# Altium project pca10040.PrjPCB (part 1 of 2)
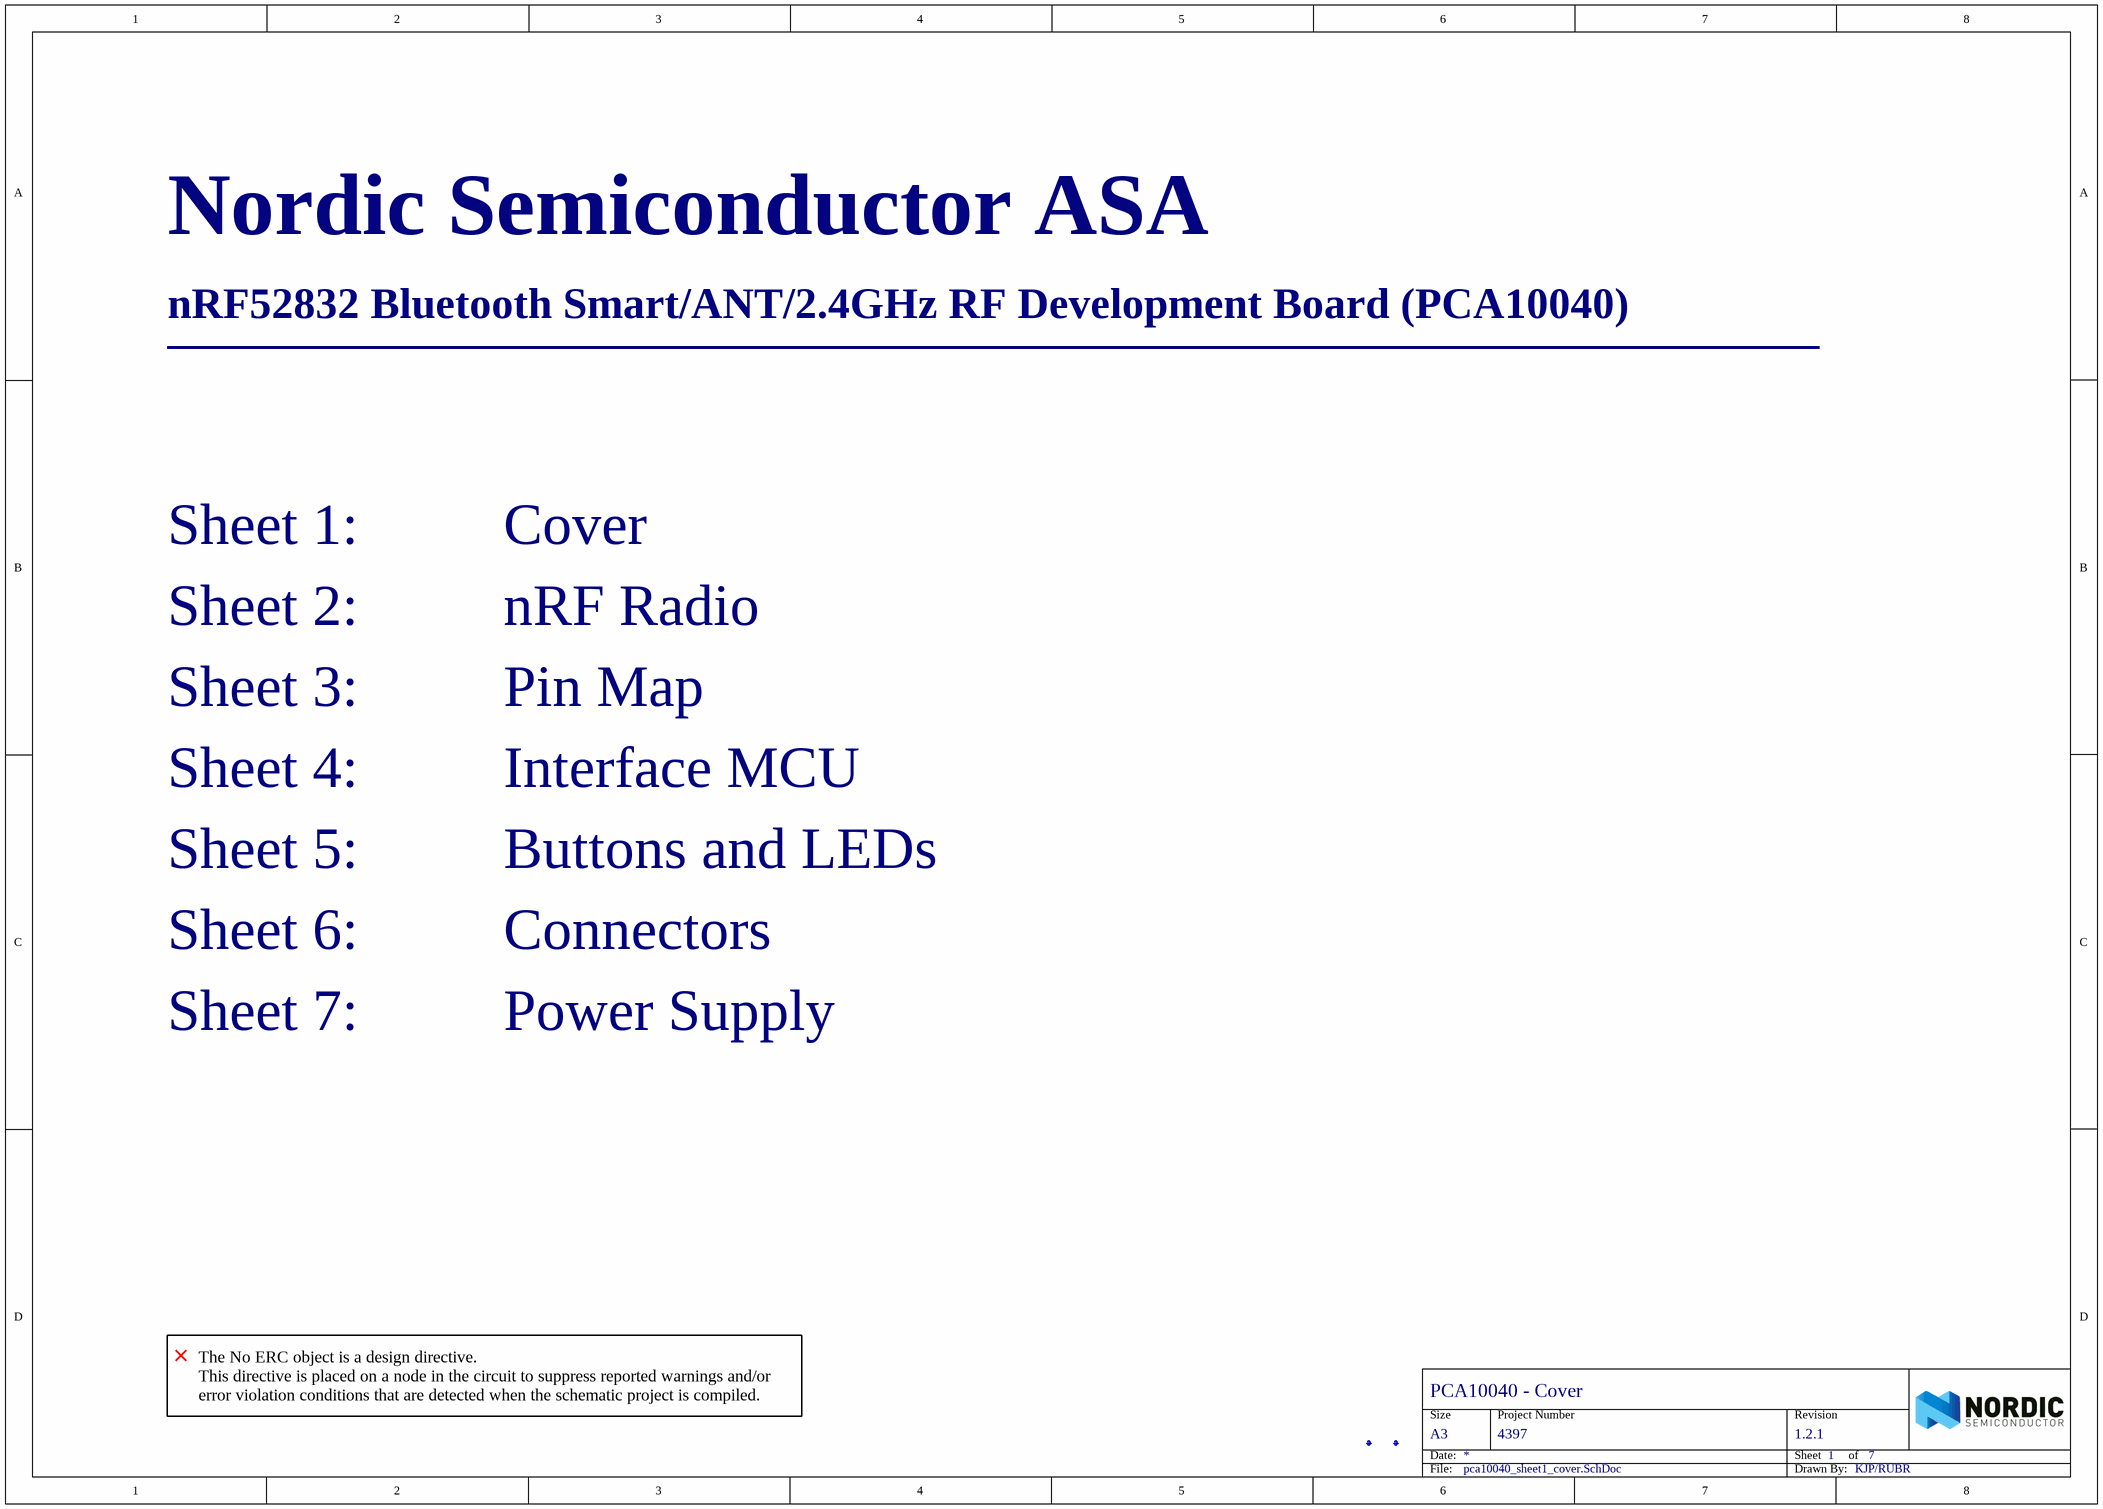
[diagram p0: pca10040_sheet1_cover.SchDoc]
7 sheets, 207 parts. Net scope: flat (ports and power ports of the same name join across sheets).
Board file: 400150.PcbDoc
Sheets:
  pca10040_sheet1_cover.SchDoc
  pca10040_sheet2_radio.SchDoc
  pca10040_sheet3_pin_map.SchDoc
  pca10040_sheet4_interface_mcu.SchDoc
  pca10040_sheet5_buttons_and_leds.SchDoc
  pca10040_sheet6_connectors.SchDoc
  pca10040_sheet7_power_supply.SchDoc

## Sheet pca10040_sheet1_cover.SchDoc: PCA10040 - Cover
size A3; Organization: Nordic Semiconductor; DocumentNumber: 1; Revision: 1.2.1; SheetNumber: 1; SheetTotal: 7; CompanyName: Nordic Semiconductor; DrawnBy: KJP/RUBR; ProjectNumber: 4397; DocumentSize: A3; PCBRevision: 0256RUBR; PCAName: PCA10040; PCBNumber: 400150; ProjectName: Quark

### Parts
Fid1  Fiducial mark  [Fiducial]  (value not drawn)
Fid2  Fiducial mark  [Fiducial]  (value not drawn)

### Notes on the sheet
- Nordic Semiconductor ASA
- nRF52832 Bluetooth Smart/ANT/2.4GHz RF Development Board (PCA10040)
- ________________________________________________________
- Sheet 1:          Cover
- Sheet 2:          nRF Radio
- Sheet 3:          Pin Map
- Sheet 4:          Interface MCU
- Sheet 5:          Buttons and LEDs
- Sheet 6:          Connectors
- Sheet 7:          Power Supply
- The No ERC object is a design directive.
  This directive is placed on a node in the circuit to suppress reported warnings and/or error violation conditions that are detected when the schematic project is compiled.
- Size
- Date:
- Project Number
- Sheet         of
- Revision
- File:
- Drawn By:

### Library data of the parts
Fid1 Fid2 = Fid-Mark: Artikkelnr Noca: N.A.; Part Number: Fid-Mark; Manufacturer: *; Manufacturer Part Number: *; Datasheet: *; LatestRevisionDate: 2009-12-12; Pin Count: 1; Publisher: Nordic Semiconductor; Published: 2009-12-12; Value: *; Note: *; Supplier: *; Supplier part number: *; 2nd source Supplier: *; 2nd source part number: *; Footprint Doc: Fiducial; Artikkelnr Simpro: N.A.

## Sheet pca10040_sheet2_radio.SchDoc: PCA10040 - nRF Radio
size A4; Organization: Nordic Semiconductor; DocumentNumber: 2; Revision: 1.2.1; SheetNumber: 2; SheetTotal: 7; CompanyName: Nordic Semiconductor; DrawnBy: KJP/RUBR; ProjectNumber: 4397; PCBRevision: 0256RUBR; DocumentSize: A4; PCAName: PCA10040; PCBNumber: 400150; ProjectName: Quark
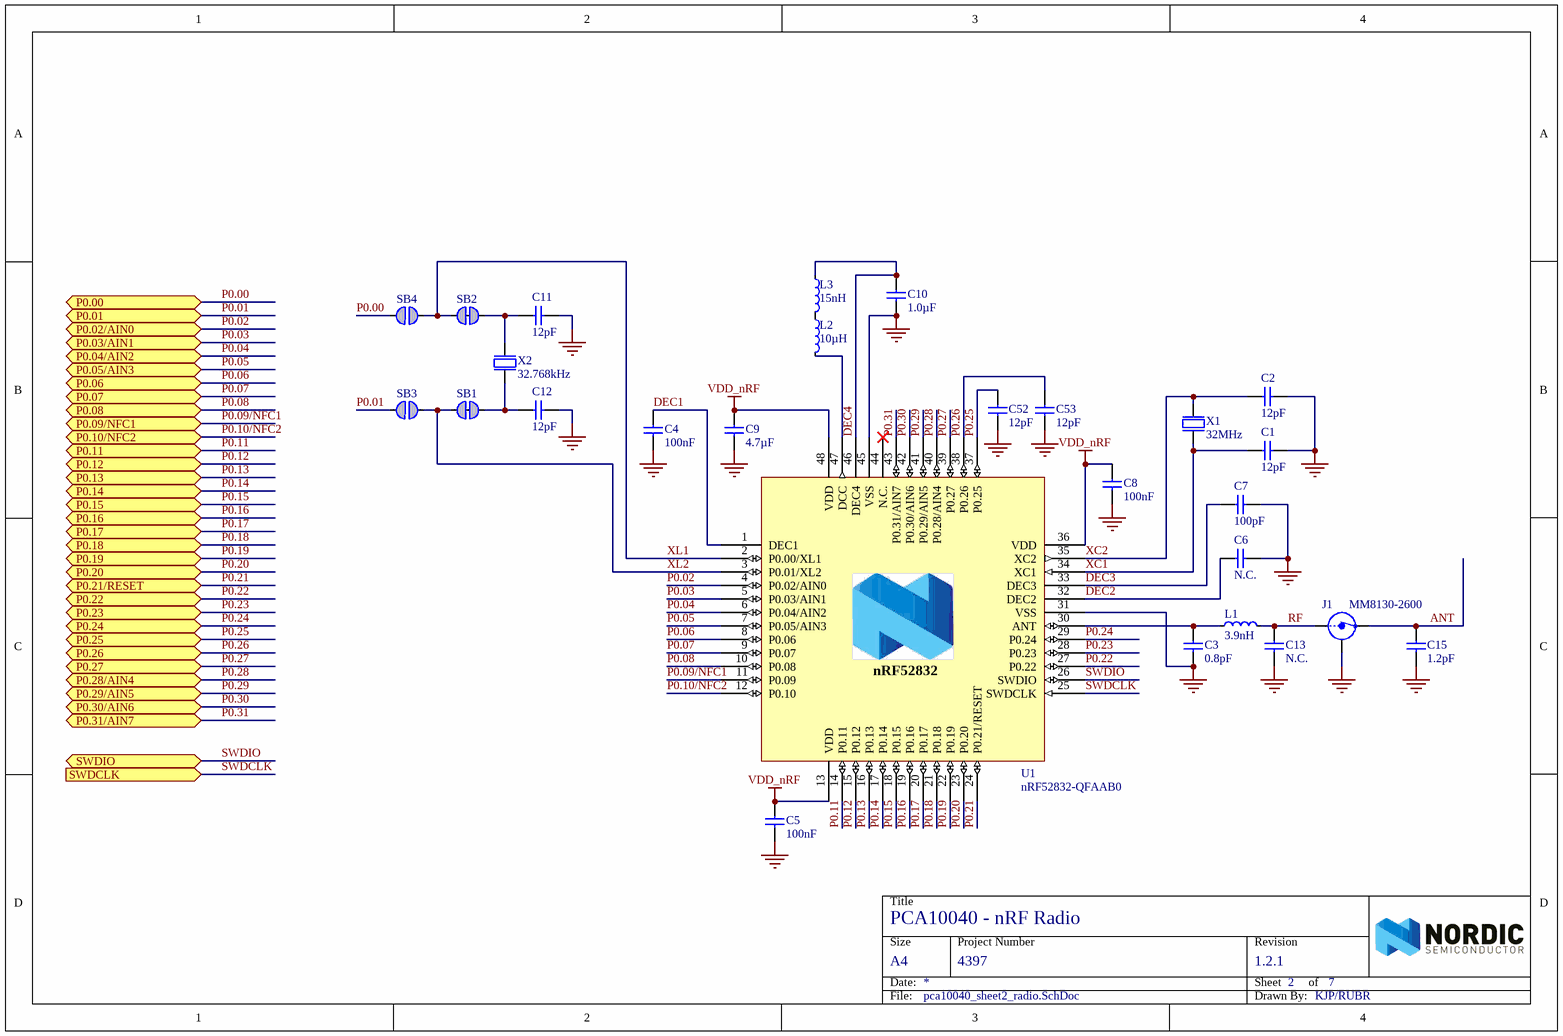
[diagram p1: pca10040_sheet2_radio.SchDoc]

### Parts
C1  12pF  [CAPC1005X04L]
C2  12pF  [CAPC1005X04L]
C3  0.8pF  [CAPC1005X04L]
C4  100nF  [CAPC1005X04L]
C5  100nF  [CAPC1005X04L]
C6  N.C.  [CAPC1005X04L]
C7  100pF  [CAPC1005X04L]
C8  100nF  [CAPC1005X04L]
C9  4.7µF  [CAPC1608X06L]
C10  1.0µF  [CAPC1608X06L]
C11  12pF  [CAPC1005X04L]
C12  12pF  [CAPC1005X04L]
C13  N.C.  [CAPC1005X04L]
C15  1.2pF  [CAPC1005X04L]
C52  12pF  [CAPC1005X04L]
C53  12pF  [CAPC1005X04L]
J1  MM8130-2600  [COAXIAL-SWF]
L1  3.9nH  [INDC1005X04L]
L2  10µH  [INDC1608X06L]
L3  15nH  [INDC1005X04L]
SB1  Solderbridge  [Solderbridge_Shorted]  (value not drawn)  (net tie, no BOM)
SB2  Solderbridge  [Solderbridge_Shorted]  (value not drawn)  (net tie, no BOM)
SB3  Solderbridge  [Solderbridge]  (value not drawn)  (no BOM)
SB4  Solderbridge  [Solderbridge]  (value not drawn)  (no BOM)
U1  nRF52832-QFAAB0  [QFN40P600X600X90-48N]
X1  32MHz  [BT-XTAL_2016]
X2  32.768kHz  [XTAL_3215]

### Ports
P0.00 (bidir), P0.01 (bidir), P0.02/AIN0 (bidir), P0.03/AIN1 (bidir), P0.04/AIN2 (bidir), P0.05/AIN3 (bidir), P0.06 (bidir), P0.07 (bidir), P0.08 (bidir), P0.09/NFC1 (bidir), P0.10/NFC2 (bidir), P0.11 (bidir), P0.12 (bidir), P0.13 (bidir), P0.14 (bidir), P0.15 (bidir), P0.16 (bidir), P0.17 (bidir), P0.18 (bidir), P0.19 (bidir), P0.20 (bidir), P0.21/RESET (bidir), P0.22 (bidir), P0.23 (bidir), P0.24 (bidir), P0.25 (bidir), P0.26 (bidir), P0.27 (bidir), P0.28/AIN4 (bidir), P0.29/AIN5 (bidir), P0.30/AIN6 (bidir), P0.31/AIN7 (bidir), SWDCLK (in), SWDIO (bidir)

### Nets
GND: C1.2 C2.2 C3.1 C4.2 C5.2 C6.2 C7.2 C8.2 C9.2 C10.1 C11.1 C12.1 C13.2 C15.2 C52.2 C53.2 J1.2(Shield) U1.31(VSS) U1.45(VSS) U1.49(GND) X1.2(GND) X1.4(GND)
VDD_nRF: C5.1 C8.1 C9.1 U1.13(VDD) U1.36(VDD) U1.48(VDD)
ANT: C15.1 J1.3(OUT)
DEC1: C4.1 U1.1(DEC1)
DEC2: C6.1 U1.32(DEC2)
DEC3: C7.1 U1.33(DEC3)
DEC4: C10.2 L3.1 U1.46(DEC4)
P0.00: SB4.2 ; port P0.00
P0.01: SB3.2 ; port P0.01
P0.02: U1.4(P0.02/AIN0) ; port P0.02/AIN0
P0.03: U1.5(P0.03/AIN1) ; port P0.03/AIN1
P0.04: U1.6(P0.04/AIN2) ; port P0.04/AIN2
P0.05: U1.7(P0.05/AIN3) ; port P0.05/AIN3
P0.06: U1.8(P0.06) ; port P0.06
P0.07: U1.9(P0.07) ; port P0.07
P0.08: U1.10(P0.08) ; port P0.08
P0.09/NFC1: U1.11(P0.09) ; port P0.09/NFC1
P0.10/NFC2: U1.12(P0.10) ; port P0.10/NFC2
P0.11: U1.14(P0.11) ; port P0.11
P0.12: U1.15(P0.12) ; port P0.12
P0.13: U1.16(P0.13) ; port P0.13
P0.14: U1.17(P0.14) ; port P0.14
P0.15: U1.18(P0.15) ; port P0.15
P0.16: U1.19(P0.16) ; port P0.16
P0.17: U1.20(P0.17) ; port P0.17
P0.18: U1.21(P0.18) ; port P0.18
P0.19: U1.22(P0.19) ; port P0.19
P0.20: U1.23(P0.20) ; port P0.20
P0.21: U1.24(P0.21/RESET) ; port P0.21/RESET
P0.22: U1.27(P0.22) ; port P0.22
P0.23: U1.28(P0.23) ; port P0.23
P0.24: U1.29(P0.24) ; port P0.24
P0.25: C52.1 U1.37(P0.25) ; port P0.25
P0.26: C53.1 U1.38(P0.26) ; port P0.26
P0.27: U1.39(P0.27) ; port P0.27
P0.28: U1.40(P0.28/AIN4) ; port P0.28/AIN4
P0.29: U1.41(P0.29/AIN5) ; port P0.29/AIN5
P0.30: U1.42(P0.30/AIN6) ; port P0.30/AIN6
P0.31: U1.43(P0.31/AIN7) ; port P0.31/AIN7
RF: C13.1 J1.1(IN) L1.2
SWDCLK: U1.25(SWDCLK) ; port SWDCLK
SWDIO: U1.26(SWDIO) ; port SWDIO
XC1: C1.1 U1.34(XC1) X1.1(inp)
XC2: C2.1 U1.35(XC2) X1.3(out)
XL1: SB2.2 SB4.1 U1.2(P0.00/XL1)
XL2: SB1.2 SB3.1 U1.3(P0.01/XL2)
NetC3_2: C3.2 L1.1 U1.30(ANT)
NetC11_2: C11.2 SB2.1 X2.1(inp)
NetC12_2: C12.2 SB1.1 X2.2(out)
NetL2_1: L2.1 L3.2
NetL2_2: L2.2 U1.47(DCC)

Not connected (* = marked no-connect by the designer): U1 44(N.C.)*

### Notes on the sheet
- Title
- Size
- Date:
- Project Number
- Sheet         of
- Revision
- File:
- Drawn By:
- (in symbol nRF52832-QFAAB0) nRF52832

### Library data of the parts
C1 C2 C11 C12 C52 C53 = C0402-12p: Capacitor, NP0, ±2%; Part number IPS: 00000002398; Note: 50V; Artikkelnr Noca: 20029159; Artikkelnr Simpro: N.A.; Part Number: C0402-12p; Manufacturer: *; Manufacturer Part Number: *; Datasheet: *; LatestRevisionDate: 2011-05-11; Pin Count: 2; Publisher: Nordic Semiconductor; Published: 2009-05-08; Value: 12pF; Supplier: *; Supplier part number: *; 2nd source Supplier: *; 2nd source part number: *; Footprint Doc: 0402
C3 = C0402-0.8p: Capacitor, NP0, ±5%; Note: 50V; Artikkelnr Noca: 20029147; Artikkelnr Simpro: N.A.; Part Number: C0402-0.8p; Manufacturer: *; Manufacturer Part Number: *; Datasheet: *; LatestRevisionDate: 2012-11-21; Pin Count: 2; Publisher: Nordic Semiconductor; Published: 2009-05-08; Value: 0.8pF; Supplier: *; Supplier part number: *; 2nd source Supplier: *; 2nd source part number: *; Footprint Doc: 0402
C4 C5 C8 = C0402-100n: Capacitor, X7R, ±10%; Part number IPS: 00000005296; Note: 16V; Artikkelnr Noca: 20039200; Artikkelnr Simpro: N.A.; Part Number: C0402-100n; Manufacturer: *; Manufacturer Part Number: *; Datasheet: *; LatestRevisionDate: 2009-11-23; Pin Count: 2; Publisher: Nordic Semiconductor; Published: 2009-05-08; Value: 100nF; Supplier: *; Supplier part number: *; 2nd source Supplier: *; 2nd source part number: *; Footprint Doc: 0402
C6 C13 = C0402-N.C.: Not mounted; Note: Chip Cap; Artikkelnr Noca: N.A.; Assembly: Not mounted; Part Number: C0402-N.C.; Manufacturer: *; Manufacturer Part Number: *; Datasheet: *; Footprint Doc: 0402; LatestRevisionDate: 2009-05-08; Pin Count: 2; Publisher: Nordic Semiconductor; Published: 2009-05-08; Value: N.C.; Supplier: *; Supplier part number: *; 2nd source Supplier: *; 2nd source part number: *; Artikkelnr Simpro: N.A.
C7 = C0402-100p: Capacitor, NP0, ±5%; Part number IPS: 00000002361; Note: 50V; Artikkelnr Noca: 20029135; Artikkelnr Simpro: N.A.; Part Number: C0402-100p; Manufacturer: *; Manufacturer Part Number: *; Datasheet: *; LatestRevisionDate: 2009-05-08; Pin Count: 2; Publisher: Nordic Semiconductor; Published: 2009-05-08; Value: 100pF; Supplier: *; Supplier part number: *; 2nd source Supplier: *; 2nd source part number: *; Footprint Doc: 0402
C9 = C0603-4µ7: Capacitor, X5R, ±10%; Part number IPS: 00000003141; Note: 6.3V; Artikkelnr Noca: 20069060; Artikkelnr Simpro: N.A.; Part Number: C0603-4µ7; Manufacturer: *; Manufacturer Part Number: *; Datasheet: *; LatestRevisionDate: 2009-11-23; Pin Count: 2; Publisher: Nordic Semiconductor; Published: 2009-05-08; Value: 4.7µF; Supplier: *; Supplier part number: *; 2nd source Supplier: *; 2nd source part number: *; Footprint Doc: 0603
C10 = C0603-1µ0: Capacitor, X7R, ±10%; Part number IPS: 00000000616; Note: 16V; Artikkelnr Noca: 20039335; Artikkelnr Simpro: N.A.; Part Number: C0603-1µ0; Manufacturer: *; Manufacturer Part Number: *; Datasheet: *; LatestRevisionDate: 2013-06-05; Pin Count: 2; Publisher: Nordic Semiconductor; Published: 2009-05-08; Value: 1.0µF; Supplier: *; Supplier part number: *; 2nd source Supplier: *; 2nd source part number: *; Footprint Doc: 0603
C15 = C0402-1.2p: Capacitor, NP0, ±0.1pF; Part number IPS: 00000005410; Note: 50V; Artikkelnr Noca: 20029157; Artikkelnr Simpro: N.A.; Part Number: C0402-1.2p; Manufacturer: *; Manufacturer Part Number: *; Datasheet: *; LatestRevisionDate: 2011-05-11; Pin Count: 2; Publisher: Nordic Semiconductor; Published: 2009-05-08; Value: 1.2pF; Supplier: *; Supplier part number: *; 2nd source Supplier: *; 2nd source part number: *; Footprint Doc: 0402
J1 = MM8130-2600: Coaxial Connector with Switch; Manufacturer: Murata; 2nd source part number: 81-MM8130-2600RA2; Artikkelnr Noca: 55029011; Artikkelnr Simpro: N.A.; Part Number: MM8130-2600; Manufacturer Part Number: MM8130-2600; Datasheet: http://www.murata.com/products/catalog/pdf/o33e.pdf; LatestRevisionDate: 2014-04-24; Pin Count: 3; Publisher: Nordic Semiconductor; Published: 2014-04-24; Value: MM8130-2600; Note: *; Supplier: Digi-Key; Supplier part number: 490-4981-1-ND; 2nd source Supplier: Mouser; Footprint Doc: COAXIAL-SWF
L1 = L0402-3n9: Inductor, 170mA, ±0.1nH; Manufacturer: Murata; Manufacturer Part Number: LQP15MN3N9B02D; Note: High frequency chip inductor ±5%; Artikkelnr Noca: 33029151; Artikkelnr Simpro: N.A.; Part Number: L0402-3n9; Datasheet: http://search.murata.co.jp/Ceramy/image/img/PDF/ENG/L0075S0084LQP15M.pdf; LatestRevisionDate: 2012-09-19; Pin Count: 2; Publisher: Nordic Semiconductor; Published: 2009-05-08; Value: 3.9nH; Supplier: Digi-Key; Supplier part number: 490-1131-1-ND; 2nd source Supplier: *; 2nd source part number: *; Footprint Doc: 0402; ComponentLink1Description: Datasheet; ComponentLink2Description: Supplier link
L2 = L0603-10µ: Inductor, 80mA, ±10%; Manufacturer: Taiyo Yuden; Manufacturer Part Number: LBMF1608T100K; 2nd source part number: 178-6105; Note: LBMF1608T100K 10µH 80mA 0603; Artikkelnr Noca: 33029314; Artikkelnr Simpro: N.A.; Part Number: L0603-10µ; Datasheet: http://www.yuden.co.jp/ut/product/pdf/elb2_e.pdf; LatestRevisionDate: 2012-09-19; Pin Count: 2; Publisher: Nordic Semiconductor; Published: 2010-02-24; Value: 10µH; Supplier: Digi-Key; Supplier part number: 587-1714-1-ND; 2nd source Supplier: Farnell; Footprint Doc: 0603; ComponentLink1Description: Datasheet; ComponentLink2Description: Supplier link
L3 = L0402-15n: Inductor, 320mA, ±5%; Manufacturer: Taiyo Yuden; Manufacturer Part Number: HK100515NJ-T; 2nd source part number: 658-1328; Note: High frequency chip inductor ±10%; Artikkelnr Noca: 33029323; Artikkelnr Simpro: N.A.; Part Number: L0402-15n; LatestRevisionDate: 2012-09-19; Pin Count: 2; Publisher: Nordic Semiconductor; Published: 2010-07-12; Value: 15nH; Supplier: Digi-Key; Datasheet: http://www.yuden.co.jp/productdata/catalog/en/mlci04_e.pdf; Supplier part number: 587-1521-1-ND; 2nd source Supplier: Farnell; Footprint Doc: 0402; ComponentLink1Description: Datasheet; ComponentLink2Description: Supplier link
SB1 SB2 = Solderbridge Shorted: Shorted Solderbridge; Artikkelnr Noca: N.A.; Part Number: Solderbridge Shorted; Manufacturer: *; Manufacturer Part Number: *; Datasheet: *; LatestRevisionDate: 2012-08-07; Pin Count: 2; Publisher: Nordic Semiconductor; Published: 2012-08-07; Value: Solderbridge; Note: *; Supplier: *; Supplier part number: *; 2nd source Supplier: *; 2nd source part number: *; Footprint Doc: Solderbridge_Shorted; Artikkelnr Simpro: N.A.
SB3 SB4 = Solderbridge: Artikkelnr Noca: N.A.; Part Number: Solderbridge; Manufacturer: *; Manufacturer Part Number: *; Datasheet: *; LatestRevisionDate: 2009-12-14; Pin Count: 2; Publisher: Nordic Semiconductor; Published: 2009-12-14; Value: Solderbridge; Note: *; Supplier: *; Supplier part number: *; 2nd source Supplier: *; 2nd source part number: *; Footprint Doc: Solderbridge; Artikkelnr Simpro: N.A.
U1 = nRF52832-QFAAB0: Multi-protocol Bluetooth Low Energy, ANT and 2.4GHz proprietary system-on-chip; Manufacturer: Nordic Semiconductor; Artikkelnr Noca: 15079334; Artikkelnr Simpro: N.A.; Part Number: nRF52832-QFAAB0; Manufacturer Part Number: nRF52832-QFAAB0; Datasheet: *; LatestRevisionDate: 2016-08-25; Pin Count: 48; Publisher: Nordic Semiconductor; Published: 2016-08-25; Value: nRF52832-QFAAB0; Note: *; Supplier: Nordic Semiconductor; Supplier part number: nRF52832-QFAAB0; 2nd source Supplier: *; 2nd source part number: *; Footprint Doc: QFN-48
X1 = XTAL_SMD2016_32MHz_8pF_Epson: XTAL SMD 2016, 32MHz, Cl=8pF, Tol: ±10ppm, Stab: ±10ppm; Manufacturer: Epson Toyocom; Manufacturer Part Number: Q22FA12800025; Note: XTAL SMD 32.000MHz; Artikkelnr Noca: 22019238; Artikkelnr Simpro: N.A.; Part Number: XTAL_SMD2016_32MHz_8pF_Epson; Datasheet: http://www.epsondevice.com/docs/qd/en/DownloadServlet?id=ID000449; LatestRevisionDate: 2014-11-27; Pin Count: 4; Publisher: Nordic Semiconductor; Published: 2012-03-09; Value: 32MHz; Supplier: Farnell; Supplier part number: 171-2806; 2nd source Supplier: *; 2nd source part number: *; Footprint Doc: XTAL_2016
X2 = XTAL_FC-135 32.768k: XTAL SMD 3215, 32.768kHz, 9pF, ±20ppm; Manufacturer: Epson Toyocom; Manufacturer Part Number: FC-135 32.768KHZ ±20PPM,9.0PF; 2nd source part number: 127-8037; Note: XTAL SMD 32.768kHz, 3215; Artikkelnr Noca: 22019091; Artikkelnr Simpro: N.A.; Part Number: XTAL_FC-135 32.768k; Datasheet: http://www.farnell.com/datasheets/57480.pdf; LatestRevisionDate: 2014-03-27; Pin Count: 2; Publisher: Nordic Semiconductor; Published: 2010-10-18; Value: 32.768kHz; Supplier: Digi-Key; Supplier part number: FC-135 32.7680KA-AC-ND; 2nd source Supplier: Farnell; Footprint Doc: XTAL_3215

## Sheet pca10040_sheet3_pin_map.SchDoc: PCA10056 - Pin Map
size A4; Organization: Nordic Semiconductor; DocumentNumber: 3; Revision: 1.2.1; SheetNumber: 3; SheetTotal: 7; CompanyName: Nordic Semiconductor; DrawnBy: RUBR; ProjectNumber: 4397; PCBRevision: 0256RUBR; DocumentSize: A4; PCAName: PCA10040; PCBNumber: 400150; ProjectName: nRF52840-DK
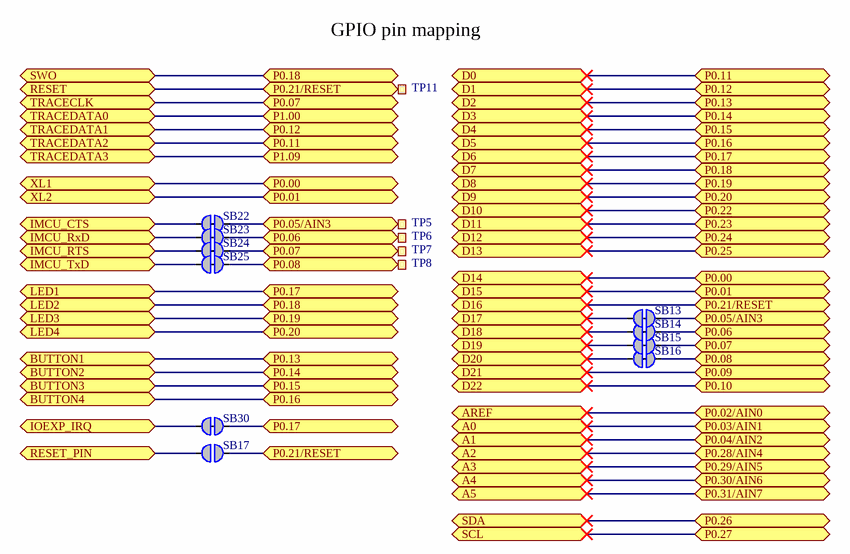
[diagram p2: pca10040_sheet3_pin_map.SchDoc]

### Parts
SB13  Solderbridge  [Solderbridge_Shorted]  (value not drawn)  (net tie, no BOM)
SB14  Solderbridge  [Solderbridge_Shorted]  (value not drawn)  (net tie, no BOM)
SB15  Solderbridge  [Solderbridge_Shorted]  (value not drawn)  (net tie, no BOM)
SB16  Solderbridge  [Solderbridge_Shorted]  (value not drawn)  (net tie, no BOM)
SB17  Solderbridge  [Solderbridge]  (value not drawn)  (no BOM)
SB22  Solderbridge  [Solderbridge_Shorted]  (value not drawn)  (net tie, no BOM)
SB23  Solderbridge  [Solderbridge_Shorted]  (value not drawn)  (net tie, no BOM)
SB24  Solderbridge  [Solderbridge_Shorted]  (value not drawn)  (net tie, no BOM)
SB25  Solderbridge  [Solderbridge_Shorted]  (value not drawn)  (net tie, no BOM)
SB30  Solderbridge  [Solderbridge_Shorted]  (value not drawn)  (net tie, no BOM)
TP5  Ø1.0mm,SMD  [TP_SMD_Ø1.0mm]  (value not drawn)  (no BOM)
TP6  Ø1.0mm,SMD  [TP_SMD_Ø1.0mm]  (value not drawn)  (no BOM)
TP7  Ø1.0mm,SMD  [TP_SMD_Ø1.0mm]  (value not drawn)  (no BOM)
TP8  Ø1.0mm,SMD  [TP_SMD_Ø1.0mm]  (value not drawn)  (no BOM)
TP11  Ø1.0mm,SMD  [TP_SMD_Ø1.0mm]  (value not drawn)  (no BOM)

### Ports
A0 (bidir), A1 (bidir), A2 (bidir), A3 (bidir), A4 (bidir), A5 (bidir), AREF (bidir), BUTTON1 (bidir), BUTTON2 (bidir), BUTTON3 (bidir), BUTTON4 (bidir), D0 (bidir), D1 (bidir), D2 (bidir), D3 (bidir), D4 (bidir), D5 (bidir), D6 (bidir), D7 (bidir), D8 (bidir), D9 (bidir), D10 (bidir), D11 (bidir), D12 (bidir), D13 (bidir), D14 (bidir), D15 (bidir), D16 (bidir), D17 (bidir), D18 (bidir), D19 (bidir), D20 (bidir), D21 (bidir), D22 (bidir), IMCU_CTS (bidir), IMCU_RTS (bidir), IMCU_RxD (bidir), IMCU_TxD (bidir), IOEXP_IRQ (bidir), LED1 (bidir), LED2 (bidir), LED3 (bidir), LED4 (bidir), P0.00 (bidir), P0.01 (bidir), P0.02/AIN0 (bidir), P0.03/AIN1 (bidir), P0.04/AIN2 (bidir), P0.05/AIN3 (bidir), P0.06 (bidir), P0.07 (bidir), P0.08 (bidir), P0.09 (bidir), P0.10 (bidir), P0.11 (bidir), P0.12 (bidir), P0.13 (bidir), P0.14 (bidir), P0.15 (bidir), P0.16 (bidir), P0.17 (bidir), P0.18 (bidir), P0.19 (bidir), P0.20 (bidir), P0.21/RESET (bidir), P0.22 (bidir), P0.23 (bidir), P0.24 (bidir), P0.25 (bidir), P0.26 (bidir), P0.27 (bidir), P0.28/AIN4 (bidir), P0.29/AIN5 (bidir), P0.30/AIN6 (bidir), P0.31/AIN7 (bidir), P1.00 (bidir), P1.09 (bidir), RESET (bidir), RESET_PIN (bidir), SCL (bidir), SDA (bidir), SWO (bidir), TRACECLK (bidir), TRACEDATA0 (bidir), TRACEDATA1 (bidir), TRACEDATA2 (bidir), TRACEDATA3 (bidir), XL1 (bidir), XL2 (bidir)

### Nets
D17: SB13.1 ; port D17
D18: SB14.1 ; port D18
D19: SB15.1 ; port D19
D20: SB16.1 ; port D20
D21: port D21, port P0.09
D22: port D22, port P0.10
IMCU_CTS: SB22.2 ; port IMCU_CTS
IMCU_RTS: SB24.2 ; port IMCU_RTS
IMCU_RxD: SB23.2 ; port IMCU_RxD
IMCU_TxD: SB25.2 ; port IMCU_TxD
IOEXP_IRQ: SB30.2 ; port IOEXP_IRQ
P0.00: port P0.00, port XL1, port D14
P0.01: port P0.01, port XL2, port D15
P0.02: port AREF, port P0.02/AIN0
P0.03: port A0, port P0.03/AIN1
P0.04: port A1, port P0.04/AIN2
P0.05: SB13.2 SB22.1 TP5.1 ; port P0.05/AIN3
P0.06: SB14.2 SB23.1 TP6.1 ; port P0.06
P0.07: SB15.2 SB24.1 TP7.1 ; port P0.07, port TRACECLK
P0.08: SB16.2 SB25.1 TP8.1 ; port P0.08
P0.11: port TRACEDATA2, port P0.11, port D0
P0.12: port TRACEDATA1, port P0.12, port D1
P0.13: port P0.13, port BUTTON1, port D2
P0.14: port P0.14, port BUTTON2, port D3
P0.15: port P0.15, port BUTTON3, port D4
P0.16: port P0.16, port BUTTON4, port D5
P0.17: SB30.1 ; port LED1, port D6, port P0.17
P0.18: port SWO, port P0.18, port LED2, port D7
P0.19: port LED3, port D8, port P0.19
P0.20: port LED4, port D9, port P0.20
P0.21: SB17.2 TP11.1 ; port RESET, port P0.21/RESET, port D16
P0.22: port D10, port P0.22
P0.23: port D11, port P0.23
P0.24: port D12, port P0.24
P0.25: port D13, port P0.25
P0.26: port P0.26, port SDA
P0.27: port P0.27, port SCL
P0.28: port A2, port P0.28/AIN4
P0.29: port A3, port P0.29/AIN5
P0.30: port A4, port P0.30/AIN6
P0.31: port A5, port P0.31/AIN7
P1.00: port TRACEDATA0, port P1.00
P1.09: port TRACEDATA3, port P1.09
RESET_PIN: SB17.1 ; port RESET_PIN

### Notes on the sheet
- (near TP11) GPIO pin mapping
- Title
- Size
- Date:
- Project Number
- Sheet         of
- Revision
- File:
- Drawn By:

### Library data of the parts
SB13-SB16 SB22-SB25 SB30 = Solderbridge Shorted: as SB1 on sheet pca10040_sheet2_radio; Part Number: Solderbridge Shorted; Manufacturer: *; Manufacturer Part Number: *; Datasheet: *; Footprint Doc: Solderbridge_Shorted; LatestRevisionDate: 2012-08-07; Pin Count: 2; Publisher: Nordic Semiconductor; Published: 2012-08-07; Value: Solderbridge; Note: *; Supplier: *; Supplier part number: *; 2nd source Supplier: *; 2nd source part number: *; Artikkelnr Simpro: N.A.
SB17 = Solderbridge: Artikkelnr Noca: N.A.; Part Number: Solderbridge; Manufacturer: *; Manufacturer Part Number: *; Datasheet: *; Footprint Doc: Solderbridge; LatestRevisionDate: 2009-12-14; Pin Count: 2; Publisher: Nordic Semiconductor; Published: 2009-12-14; Value: Solderbridge; Note: *; Supplier: *; Supplier part number: *; 2nd source Supplier: *; 2nd source part number: *; Artikkelnr Simpro: N.A.
TP5-TP8 TP11 = TP_SMD_Ø1.0MM: 1.0mm circular SMD testpad; Manufacturer: Nordic Semiconductor; Artikkelnr Noca: N.A.; Part Number: TP_SMD_Ø1.0MM; Manufacturer Part Number: *; Datasheet: *; LatestRevisionDate: 2013-06-11; Pin Count: 1; Publisher: Nordic Semiconductor; Published: 2013-06-11; Value: Ø1.0mm,SMD; Note: *; Supplier: *; Supplier part number: *; 2nd source Supplier: *; 2nd source part number: *; Footprint Doc: TP_SMD_Ø1.0mm; Artikkelnr Simpro: N.A.

## Sheet pca10040_sheet4_interface_mcu.SchDoc: PCA10040 - Interface MCU
size A3; Organization: Nordic Semiconductor; DocumentNumber: 4; Revision: 1.2.1; SheetNumber: 4; SheetTotal: 7; CompanyName: Nordic Semiconductor; DrawnBy: KJP/RUBR; ProjectNumber: 4397; PCAName: PCA10040; PCBRevision: 0256RUBR; DocumentSize: A3; PCBNumber: 400150; ProjectName: Quark
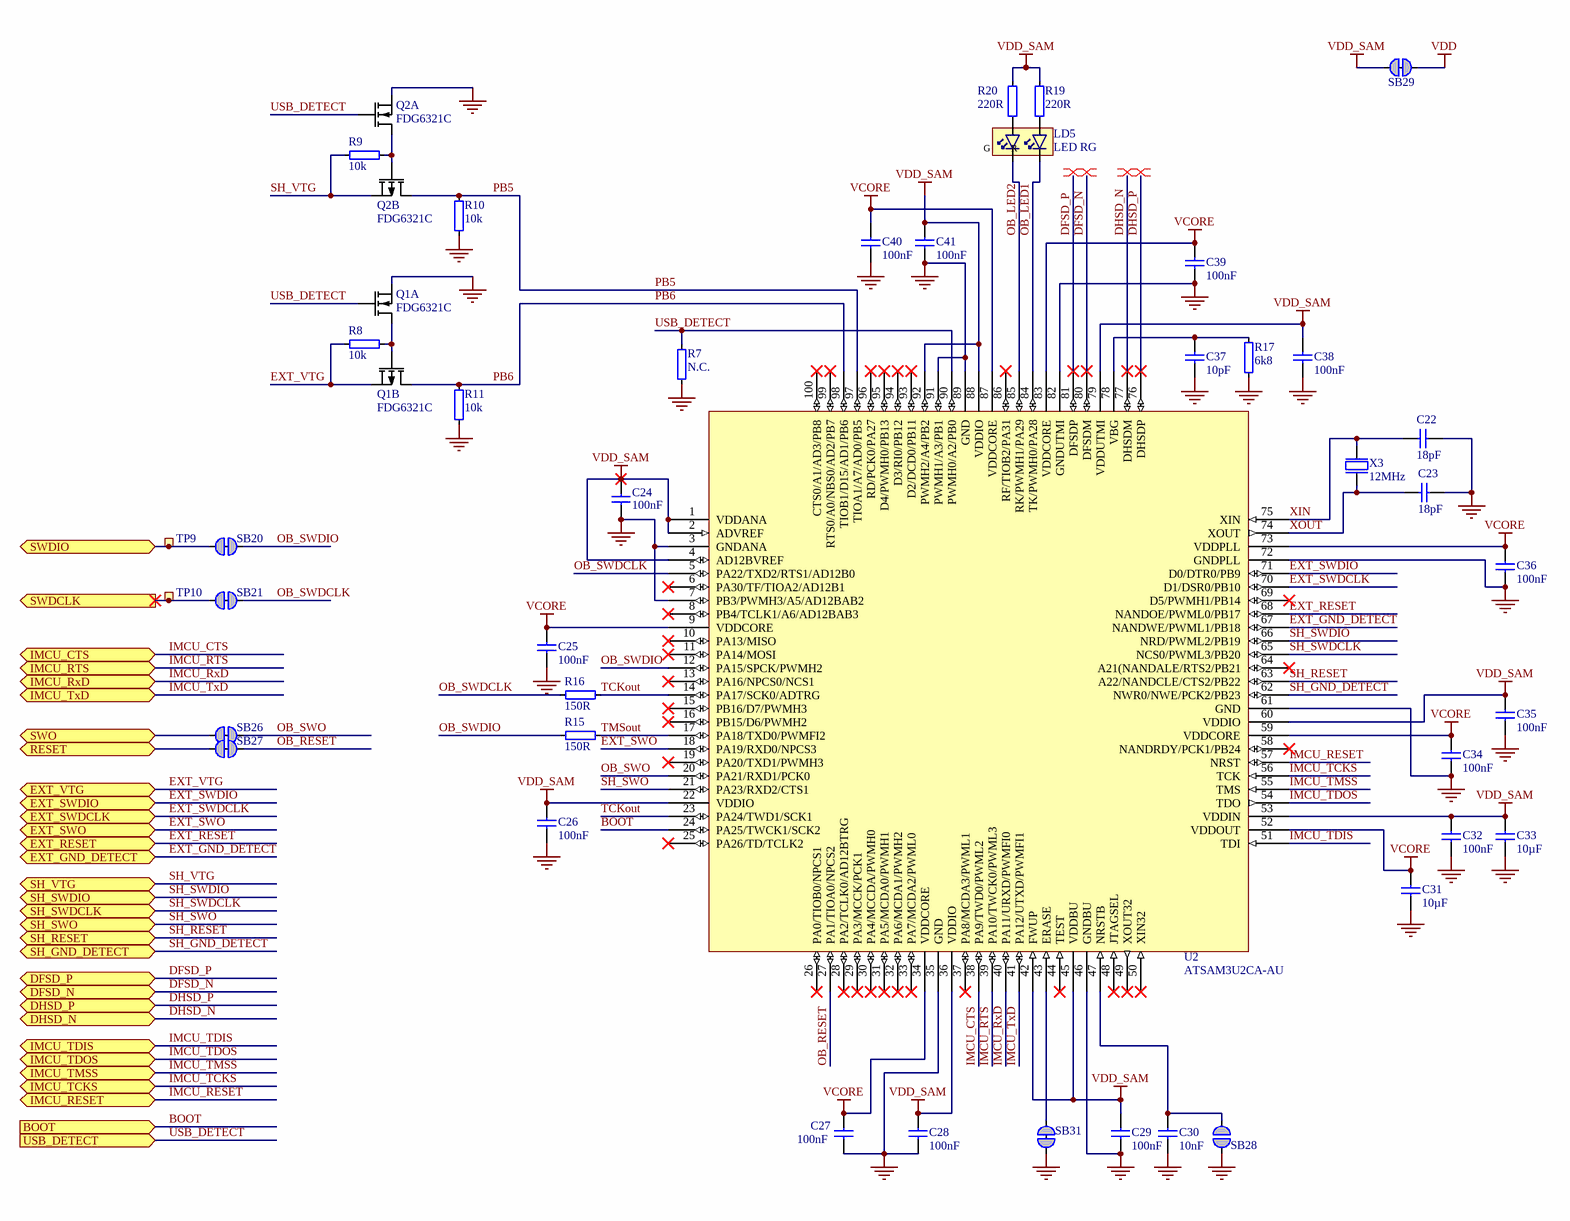
[diagram p3: pca10040_sheet4_interface_mcu.SchDoc]

### Parts
C22  18pF  [CAPC1005X04L]
C23  18pF  [CAPC1005X04L]
C24  100nF  [CAPC1005X04L]
C25  100nF  [CAPC1005X04L]
C26  100nF  [CAPC1005X04L]
C27  100nF  [CAPC1005X04L]
C28  100nF  [CAPC1005X04L]
C29  100nF  [CAPC1005X04L]
C30  10nF  [CAPC1005X04L]
C31  10µF  [CAPC1608X06L]
C32  100nF  [CAPC1005X04L]
C33  10µF  [CAPC1608X06L]
C34  100nF  [CAPC1005X04L]
C35  100nF  [CAPC1005X04L]
C36  100nF  [CAPC1005X04L]
C37  10pF  [CAPC1005X04L]
C38  100nF  [CAPC1005X04L]
C39  100nF  [CAPC1005X04L]
C40  100nF  [CAPC1005X04L]
C41  100nF  [CAPC1005X04L]
LD5  LED RG  [LED_DUAL_0606]
Q1  FDG6321C  [SOT65P210X100-6N]  (parts A,B of 2)
Q2  FDG6321C  [SOT65P210X100-6N]  (parts A,B of 2)
R7  N.C.  [RESC1005X04L]
R8  10k  [RESC1005X04L]
R9  10k  [RESC1005X04L]
R10  10k  [RESC1005X04L]
R11  10k  [RESC1005X04L]
R15  150R  [RESC1005X04L]
R16  150R  [RESC1005X04L]
R17  6k8  [RESC1005X04L]
R19  220R  [RESC1005X04L]
R20  220R  [RESC1005X04L]
SB20  Solderbridge  [Solderbridge_Shorted]  (value not drawn)  (net tie, no BOM)
SB21  Solderbridge  [Solderbridge_Shorted]  (value not drawn)  (net tie, no BOM)
SB26  Solderbridge  [Solderbridge_Shorted]  (value not drawn)  (net tie, no BOM)
SB27  Solderbridge  [Solderbridge_Shorted]  (value not drawn)  (net tie, no BOM)
SB28  Solderbridge  [Solderbridge]  (value not drawn)  (no BOM)
SB29  Solderbridge  [Solderbridge_Shorted]  (value not drawn)  (net tie, no BOM)
SB31  Solderbridge  [Solderbridge_Shorted]  (value not drawn)  (net tie, no BOM)
TP9  Ø1.0mm,SMD  [TP_SMD_Ø1.0mm]  (value not drawn)  (no BOM)
TP10  Ø1.0mm,SMD  [TP_SMD_Ø1.0mm]  (value not drawn)  (no BOM)
U2  ATSAM3U2CA-AU  [TSQFP50P1600X1600X160-100N]
X3  12MHz  [BT-XTAL_3225]

### Ports
BOOT (in), DFSD_N (bidir), DFSD_P (bidir), DHSD_N (bidir), DHSD_P (bidir), EXT_GND_DETECT (bidir), EXT_RESET (bidir), EXT_SWDCLK (bidir), EXT_SWDIO (bidir), EXT_SWO (bidir), EXT_VTG (bidir), IMCU_CTS (bidir), IMCU_RESET (bidir), IMCU_RTS (bidir), IMCU_RxD (bidir), IMCU_TCKS (bidir), IMCU_TDIS (bidir), IMCU_TDOS (bidir), IMCU_TMSS (bidir), IMCU_TxD (bidir), RESET (bidir), SH_GND_DETECT (bidir), SH_RESET (bidir), SH_SWDCLK (bidir), SH_SWDIO (bidir), SH_SWO (bidir), SH_VTG (bidir), SWDCLK (out), SWDIO (bidir), SWO (bidir), USB_DETECT (in)

### Nets
GND: C22.2 C23.2 C24.1 C25.1 C26.1 C27.1 C28.1 C29.1 C30.1 C31.1 C32.1 C33.1 C34.1 C35.1 C36.2 C37.1 C38.1 C39.1 C40.1 C41.1 Q1.1(S1) Q2.1(S1) R7.2 R10.1 R11.1 R17.1 SB28.2 SB31.2 U2.3(GNDANA) U2.7(PB3/PWMH3/A5/AD12BAB2) U2.35(GND) U2.46(GNDBU) U2.61(GND) U2.72(GNDPLL) U2.82(GNDUTMI) U2.89(GND) U2.91(PWMH1/A3/PB1) X3.2(GND) X3.4(GND)
VCORE: C25.2 C27.2 C31.2 C34.2 C36.1 C39.2 C40.2 U2.9(VDDCORE) U2.34(VDDCORE) U2.52(VDDOUT) U2.59(VDDCORE) U2.73(VDDPLL) U2.83(VDDCORE) U2.87(VDDCORE)
VDD: SB29.2
VDD_SAM: C24.2 C26.2 C28.2 C29.2 C32.2 C33.2 C35.2 C38.2 C41.2 R19.2 R20.2 SB29.1 U2.1(VDDANA) U2.2(ADVREF) U2.4(AD12BVREF) U2.22(VDDIO) U2.36(VDDIO) U2.42(FWUP) U2.45(VDDBU) U2.53(VDDIN) U2.60(VDDIO) U2.79(VDDUTMI) U2.88(VDDIO) U2.92(PWMH2/A4/PB2)
BOOT: U2.24(PA25/TWCK1/SCK2) ; port BOOT
DFSD_N: U2.80(DFSDM) ; port DFSD_N
DFSD_P: U2.81(DFSDP) ; port DFSD_P
DHSD_N: U2.77(DHSDM) ; port DHSD_N
DHSD_P: U2.76(DHSDP) ; port DHSD_P
EXT_GND_DETECT: U2.67(NANDWE/PWML1/PB18) ; port EXT_GND_DETECT
EXT_RESET: U2.68(NANDOE/PWML0/PB17) ; port EXT_RESET
EXT_SWDCLK: U2.70(D1/DSR0/PB10) ; port EXT_SWDCLK
EXT_SWDIO: U2.71(D0/DTR0/PB9) ; port EXT_SWDIO
EXT_SWO: U2.18(PA19/RXD0/NPCS3) ; port EXT_SWO
EXT_VTG: Q1.4(S2) R8.1 ; port EXT_VTG
IMCU_CTS: U2.38(PA9/TWD0/PWML2) ; port IMCU_CTS
IMCU_RESET: U2.57(NRST) ; port IMCU_RESET
IMCU_RTS: U2.39(PA10/TWCK0/PWML3) ; port IMCU_RTS
IMCU_RxD: U2.40(PA11/URXD/PWMFI0) ; port IMCU_RxD
IMCU_TCKS: U2.56(TCK) ; port IMCU_TCKS
IMCU_TDIS: U2.51(TDI) ; port IMCU_TDIS
IMCU_TDOS: U2.54(TDO) ; port IMCU_TDOS
IMCU_TMSS: U2.55(TMS) ; port IMCU_TMSS
IMCU_TxD: U2.41(PA12/UTXD/PWMFI1) ; port IMCU_TxD
OB_LED1: LD5.4(C1) U2.84(TK/PWMH0/PA28)
OB_LED2: LD5.3(C2) U2.85(RK/PWMH1/PA29)
OB_RESET: SB27.2 U2.27(PA1/TIOA0/NPCS2)
OB_SWDCLK: R16.2 SB21.2 U2.5(PA22/TXD2/RTS1/AD12B0)
OB_SWDIO: R15.2 SB20.2 U2.12(PA15/SPCK/PWMH2)
OB_SWO: SB26.2 U2.20(PA21/RXD1/PCK0)
P0.18: SB26.1 ; port SWO
P0.21: SB27.1 ; port RESET
PB5: Q2.3(D2) R10.2 U2.97(TIOA1/A7/AD0/PB5)
PB6: Q1.3(D2) R11.2 U2.98(TIOB1/D15/AD1/PB6)
SH_GND_DETECT: U2.62(NWR0/NWE/PCK2/PB23) ; port SH_GND_DETECT
SH_RESET: U2.63(A22/NANDCLE/CTS2/PB22) ; port SH_RESET
SH_SWDCLK: U2.65(NCS0/PWML3/PB20) ; port SH_SWDCLK
SH_SWDIO: U2.66(NRD/PWML2/PB19) ; port SH_SWDIO
SH_SWO: U2.21(PA23/RXD2/CTS1) ; port SH_SWO
SH_VTG: Q2.4(S2) R9.1 ; port SH_VTG
SWDCLK: SB21.1 TP10.1 ; port SWDCLK
SWDIO: SB20.1 TP9.1 ; port SWDIO
TCKout: R16.1 U2.14(PA17/SCK0/ADTRG) U2.23(PA24/TWD1/SCK1)
TMSout: R15.1 U2.17(PA18/TXD0/PWMFI2)
USB_DETECT: Q1.2(G1) Q2.2(G1) R7.1 U2.90(PWMH0/A2/PB0) ; port USB_DETECT
XIN: C22.1 U2.75(XIN) X3.3(out)
XOUT: C23.1 U2.74(XOUT) X3.1(inp)
NetC30_2: C30.2 SB28.1 U2.47(NRSTB)
NetC37_2: C37.2 R17.2 U2.78(VBG)
NetLD5_1: LD5.1(A2) R20.1
NetLD5_2: LD5.2(A1) R19.1
NetQ1_5: Q1.5(G2) Q1.6(D1) R8.2
NetQ2_5: Q2.5(G2) Q2.6(D1) R9.2
NetSB31_1: SB31.1 U2.43(ERASE)

Not connected (* = marked no-connect by the designer): U2 6(PA30/TF/TIOA2/AD12B1)* 8(PB4/TCLK1/A6/AD12BAB3)* 10(PA13/MISO)* 11(PA14/MOSI)* 13(PA16/NPCS0/NCS1)* 15(PB16/D7/PWMH3)* 16(PB15/D6/PWMH2)* 19(PA20/TXD1/PWMH3)* 25(PA26/TD/TCLK2)* 26(PA0/TIOB0/NPCS1)* 28(PA2/TCLK0/AD12BTRG)* 29(PA3/MCCK/PCK1)* 30(PA4/MCCDA/PWMH0)* 31(PA5/MCDA0/PWMH1)* 32(PA6/MCDA1/PWMH2)* 33(PA7/MCDA2/PWML0)* 37(PA8/MCDA3/PWML1)* 44(TEST)* 48(JTAGSEL)* 49(XOUT32)* 50(XIN32)* 58(NANDRDY/PCK1/PB24)* 64(A21(NANDALE/RTS2/PB21)* 69(D5/PWMH1/PB14)* 86(RF/TIOB2/PA31)* 93(D2/DCD0/PB11)* 94(D3/RI0/PB12)* 95(D4/PWMH0/PB13)* 96(RD/PCK0/PA27)* 99(RTS0/A0/NBS0/AD2/PB7)* 100(CTS0/A1/AD3/PB8)*

### Layout directives
differential pair: DFSD_N, DFSD_P, DHSD_N, DHSD_P

### Notes on the sheet
- Size
- Date:
- Project Number
- Sheet         of
- Revision
- File:
- Drawn By:
- (in symbol LTST-C195KGJRKT) G; R

### Library data of the parts
C22 C23 = C0402-18p: Capacitor, NP0, ±5%; Note: 50V; Artikkelnr Noca: 20029209; Artikkelnr Simpro: N.A.; Part Number: C0402-18p; Manufacturer: *; Manufacturer Part Number: *; Datasheet: *; LatestRevisionDate: 2009-05-08; Pin Count: 2; Publisher: Nordic Semiconductor; Published: 2009-05-08; Value: 18pF; Supplier: *; Supplier part number: *; 2nd source Supplier: *; 2nd source part number: *; Footprint Doc: 0402
C24-C29 C32 C34-C36 C38-C41 = C0402-100n: as C4 on sheet pca10040_sheet2_radio; Part Number: C0402-100n; Manufacturer: *; Manufacturer Part Number: *; Datasheet: *; LatestRevisionDate: 2009-11-23; Pin Count: 2; Publisher: Nordic Semiconductor; Published: 2009-05-08; Value: 100nF; Supplier: *; Supplier part number: *; 2nd source Supplier: *; 2nd source part number: *; Footprint Doc: 0402
C30 = C0402-10n: Capacitor, X7R, ±10%; Part number IPS: 00000002386; Note: 16V; Artikkelnr Noca: 20039166; Artikkelnr Simpro: N.A.; Part Number: C0402-10n; Manufacturer: *; Manufacturer Part Number: *; Datasheet: *; LatestRevisionDate: 2009-11-23; Pin Count: 2; Publisher: Nordic Semiconductor; Published: 2009-05-08; Value: 10nF; Supplier: *; Supplier part number: *; 2nd source Supplier: *; 2nd source part number: *; Footprint Doc: 0402
C31 C33 = C0603-10µ: Capacitor, X5R, ±20%; Part number IPS: 00000003029; Note: 6.3V; Artikkelnr Noca: 20039234; Artikkelnr Simpro: N.A.; Part Number: C0603-10µ; Manufacturer: *; Manufacturer Part Number: *; Datasheet: *; LatestRevisionDate: 2011-01-17; Pin Count: 2; Publisher: Nordic Semiconductor; Published: 2011-01-17; Value: 10µF; Supplier: *; Supplier part number: *; 2nd source Supplier: *; 2nd source part number: *; Footprint Doc: 0603
C37 = C0402-10p: Capacitor, NP0, ±2%; 2nd source part number: 185-6064; Note: 50V; Artikkelnr Noca: 20029260; Artikkelnr Simpro: N.A.; Part Number: C0402-10p; Manufacturer: *; Manufacturer Part Number: *; Datasheet: *; LatestRevisionDate: 2009-05-08; Pin Count: 2; Publisher: Nordic Semiconductor; Published: 2009-05-08; Value: 10pF; Supplier: Digi-Key; Supplier part number: 712-1252-1-ND; 2nd source Supplier: Farnell; Footprint Doc: 0402
LD5 = LTST-C195KGJRKT: Ultra bright AlInGaP Bi-Color LED; Manufacturer: Lite-On Inc; 2nd source part number: 859-LTST-C195KGJRKT; Artikkelnr Noca: 13019145; Artikkelnr Simpro: N.A.; Part Number: LTST-C195KGJRKT; Manufacturer Part Number: LTST-C195KGJRKT; Datasheet: http://media.digikey.com/pdf/Data%20Sheets/Lite-On%20PDFs/LTST-C195KGJRKT.pdf; LatestRevisionDate: 2013-02-11; Pin Count: 4; Publisher: Nordic Semiconductor; Published: 2012-07-05; Value: LED RG; Note: *; Supplier: Digi-Key; Supplier part number: 160-1452-1-ND; 2nd source Supplier: Mouser; Footprint Doc: LED_DUAL_0606
Q1 Q2 = FDG6321C: Fairchild, FDG6321C, Dual N & P Channel Digital FET; 2nd source part number: FDG6321CCT-ND; Artikkelnr Noca: 35029089; Artikkelnr Simpro: N.A.; Part Number: FDG6321C; Manufacturer: Fairchild; Manufacturer Part Number: FDG6321C; Datasheet: http://www.fairchildsemi.com/ds/FD/FDG6321C.pdf; LatestRevisionDate: 2011-05-11; Pin Count: 6; Publisher: Nordic Semiconductor; Published: 2009-09-16; Value: FDG6321C; Note: Dual N & P Channel Digital FET; Supplier: Farnell; Supplier part number: 170-0689; 2nd source Supplier: Digi-Key; Footprint Doc: SC70-6
R7 = R0402-N.C.: Not mounted; Note: Chip Res; Artikkelnr Noca: N.A.; Assembly: Not mounted; Part Number: R0402-N.C.; Manufacturer: *; Manufacturer Part Number: *; Datasheet: *; LatestRevisionDate: 2009-05-08; Pin Count: 2; Publisher: Nordic Semiconductor; Published: 2009-05-08; Value: N.C.; Supplier: *; Supplier part number: *; 2nd source Supplier: *; 2nd source part number: *; Footprint Doc: 0402; Artikkelnr Simpro: N.A.
R8-R11 = R0402-10k: Resistor, ±1%, 0.063W; Part number IPS: 00000002093; Note: Chip Res 1%; Artikkelnr Noca: 27049097; Artikkelnr Simpro: N.A.; Value Ohm: 10000; Part Number: R0402-10k; Manufacturer: *; Manufacturer Part Number: *; Datasheet: *; LatestRevisionDate: 2009-11-23; Pin Count: 2; Publisher: Nordic Semiconductor; Published: 2009-05-08; Value: 10k; Supplier: Farnell; Supplier part number: 173-8864; 2nd source Supplier: *; 2nd source part number: *; Footprint Doc: 0402
R15 R16 = R0402-150: Resistor, ±1%, 0.063W; Note: Chip Res 1%; Artikkelnr Noca: 27049053; Artikkelnr Simpro: N.A.; Value Ohm: 150; Part Number: R0402-150; Manufacturer: *; Manufacturer Part Number: *; Datasheet: *; LatestRevisionDate: 2009-11-23; Pin Count: 2; Publisher: Nordic Semiconductor; Published: 2009-05-08; Value: 150R; Supplier: Farnell; Supplier part number: 173-8839; 2nd source Supplier: *; 2nd source part number: *; Footprint Doc: 0402
R17 = R0402-6k8: Resistor, ±1%, 0.063W; Note: Chip Res 1%; Artikkelnr Noca: 27049093; Artikkelnr Simpro: N.A.; Value Ohm: 6800; Part Number: R0402-6k8; Manufacturer: *; Manufacturer Part Number: *; Datasheet: *; LatestRevisionDate: 2009-11-23; Pin Count: 2; Publisher: Nordic Semiconductor; Published: 2009-05-08; Value: 6k8; Supplier: Farnell; Supplier part number: 173-8862; 2nd source Supplier: *; 2nd source part number: *; Footprint Doc: 0402
R19 R20 = R0402-220: Resistor, ±1%, 0.063W; Note: Chip Res 1%; Artikkelnr Noca: 27049057; Artikkelnr Simpro: N.A.; Value Ohm: 220; Part Number: R0402-220; Manufacturer: *; Manufacturer Part Number: *; Datasheet: *; LatestRevisionDate: 2009-11-23; Pin Count: 2; Publisher: Nordic Semiconductor; Published: 2009-05-08; Value: 220R; Supplier: Farnell; Supplier part number: 173-8841; 2nd source Supplier: *; 2nd source part number: *; Footprint Doc: 0402
SB20 SB21 SB26 SB27 SB29 SB31 = Solderbridge Shorted: as SB1 on sheet pca10040_sheet2_radio; Part Number: Solderbridge Shorted; Manufacturer: *; Manufacturer Part Number: *; Datasheet: *; LatestRevisionDate: 2012-08-07; Pin Count: 2; Publisher: Nordic Semiconductor; Published: 2012-08-07; Value: Solderbridge; Note: *; Supplier: *; Supplier part number: *; 2nd source Supplier: *; 2nd source part number: *; Footprint Doc: Solderbridge_Shorted; Artikkelnr Simpro: N.A.
SB28 = Solderbridge: Artikkelnr Noca: N.A.; Part Number: Solderbridge; Manufacturer: *; Manufacturer Part Number: *; Datasheet: *; LatestRevisionDate: 2009-12-14; Pin Count: 2; Publisher: Nordic Semiconductor; Published: 2009-12-14; Value: Solderbridge; Note: *; Supplier: *; Supplier part number: *; 2nd source Supplier: *; 2nd source part number: *; Footprint Doc: Solderbridge; Artikkelnr Simpro: N.A.
TP9 TP10 = TP_SMD_Ø1.0MM: as TP5 on sheet pca10040_sheet3_pin_map; Part Number: TP_SMD_Ø1.0MM; Manufacturer Part Number: *; Datasheet: *; LatestRevisionDate: 2013-06-11; Pin Count: 1; Publisher: Nordic Semiconductor; Published: 2013-06-11; Value: Ø1.0mm,SMD; Note: *; Supplier: *; Supplier part number: *; 2nd source Supplier: *; 2nd source part number: *; Footprint Doc: TP_SMD_Ø1.0mm; Artikkelnr Simpro: N.A.
U2 = ATSAM3U2CA-AU: IC MCU 32bit 128kB flash 100LQFP; Manufacturer: Atmel; 2nd source part number: 184-1662; Artikkelnr Noca: 15019073; Artikkelnr Simpro: N.A.; Part Number: ATSAM3U2CA-AU; Manufacturer Part Number: ATSAM3U2CA-AU; Datasheet: http://www.atmel.com/Images/6430s.pdf; LatestRevisionDate: 2012-06-01; Pin Count: 100; Publisher: Nordic Semiconductor; Published: 2012-06-01; Value: ATSAM3U2CA-AU; Note: *; Supplier: Digi-Key; Supplier part number: ATSAM3U2CA-AU-ND; 2nd source Supplier: Farnell; Footprint Doc: LQFP-100
X3 = XTAL_SMD3225_12MHz_18pF_TXC: XTAL SMD 3225, 12MHz, Cl=18pF, Tol: ±30ppm, Stab: ±30ppm; Manufacturer: TXC Corporation; Manufacturer Part Number: 7M-12.000MAAJ-T; 2nd source part number: 184-2056; Note: XTAL SMD 12.000MHz; Artikkelnr Noca: 22019166; Artikkelnr Simpro: N.A.; Part Number: XTAL_SMD3225_12MHz_18pF_TXC; Datasheet: http://www.txccrystal.com/images/pdf/7m.pdf; LatestRevisionDate: 2014-11-27; Pin Count: 4; Publisher: Nordic Semiconductor; Published: 2010-08-31; Value: 12MHz; Supplier: Digi-Key; Supplier part number: 887-1121-1-ND; 2nd source Supplier: Farnell; Footprint Doc: XTAL_3225

## Sheet pca10040_sheet5_buttons_and_leds.SchDoc: PCA10040 - Buttons and LEDs
size A4; Organization: Nordic Semiconductor; DocumentNumber: 5; Revision: 1.2.1; SheetNumber: 5; SheetTotal: 7; CompanyName: Nordic Semiconductor; DrawnBy: KJP/RUBR; ProjectNumber: 4397; PCBRevision: 0256RUBR; DocumentSize: A4; PCAName: PCA10040; PCBNumber: 400150; ProjectName: Quark
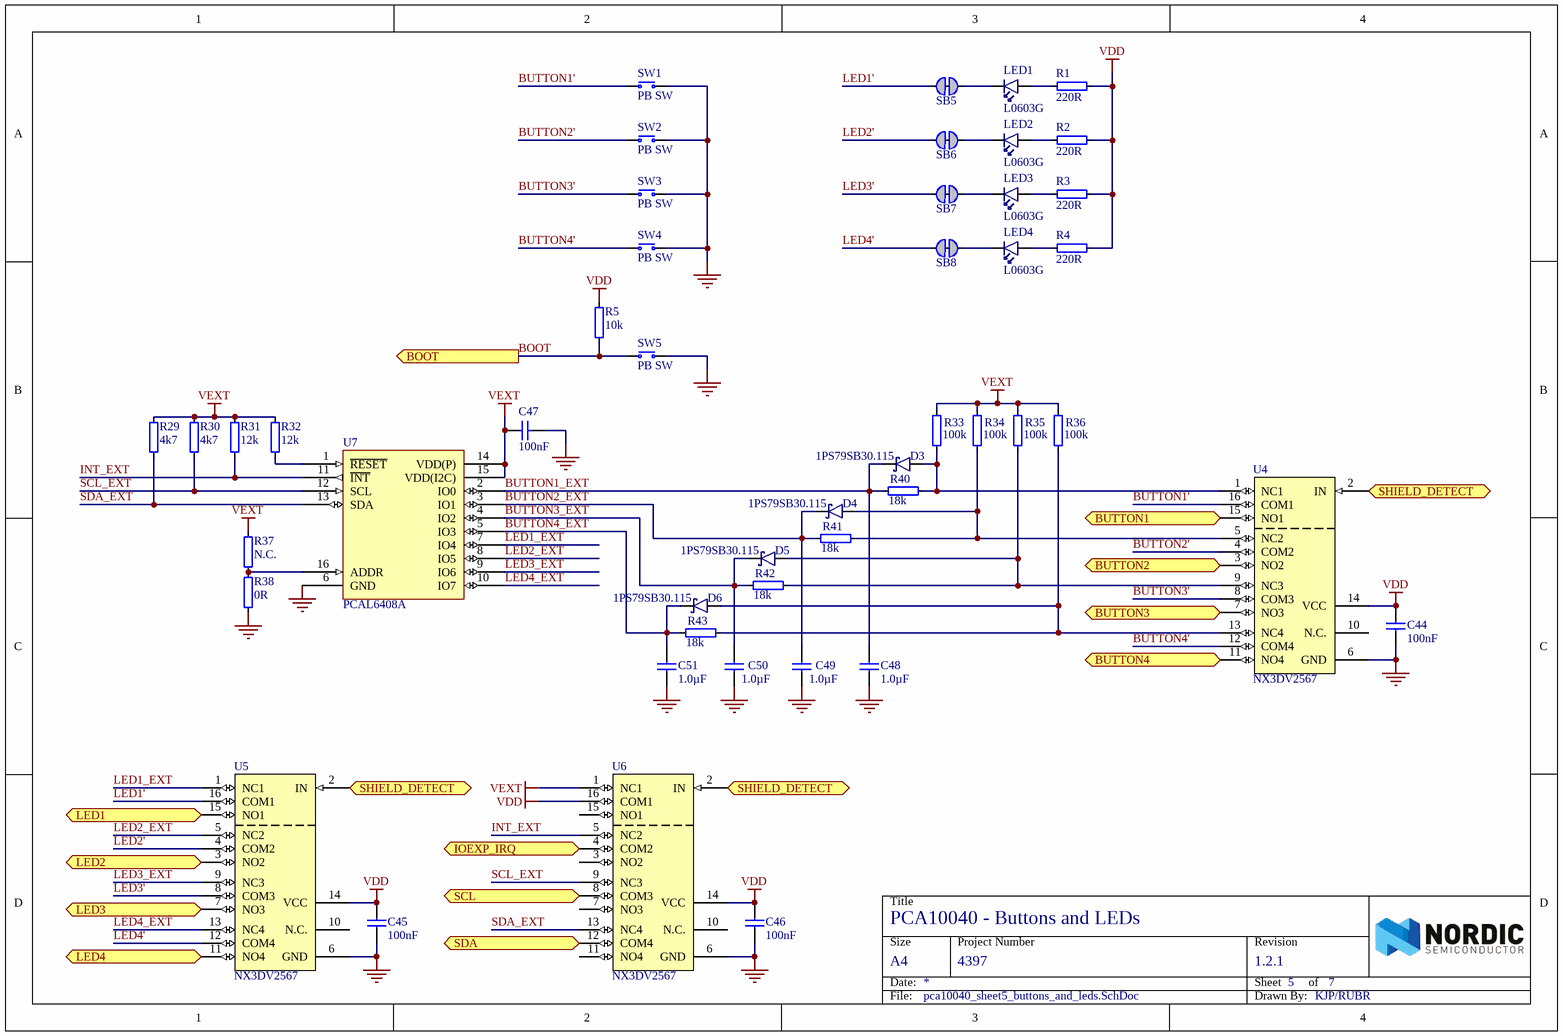
[diagram p4: pca10040_sheet5_buttons_and_leds.SchDoc]

### Parts
C44  100nF  [CAPC1005X04L]
C45  100nF  [CAPC1005X04L]
C46  100nF  [CAPC1005X04L]
C47  100nF  [CAPC1005X04L]
C48  1.0µF  [CAPC1005X04L]
C49  1.0µF  [CAPC1005X04L]
C50  1.0µF  [CAPC1005X04L]
C51  1.0µF  [CAPC1005X04L]
D3  1PS79SB30.115  [SOD-523]
D4  1PS79SB30.115  [SOD-523]
D5  1PS79SB30.115  [SOD-523]
D6  1PS79SB30.115  [SOD-523]
LED1  L0603G  [LED_0603_G]
LED2  L0603G  [LED_0603_G]
LED3  L0603G  [LED_0603_G]
LED4  L0603G  [LED_0603_G]
R1  220R  [RESC1005X04L]
R2  220R  [RESC1005X04L]
R3  220R  [RESC1005X04L]
R4  220R  [RESC1005X04L]
R5  10k  [RESC1005X04L]
R29  4k7  [RESC1005X04L]
R30  4k7  [RESC1005X04L]
R31  12k  [RESC1005X04L]
R32  12k  [RESC1005X04L]
R33  100k  [RESC1005X04L]
R34  100k  [RESC1005X04L]
R35  100k  [RESC1005X04L]
R36  100k  [RESC1005X04L]
R37  N.C.  [RESC1005X04L]
R38  0R  [RESC1005X04L]
R40  18k  [RESC1005X04L]
R41  18k  [RESC1005X04L]
R42  18k  [RESC1005X04L]
R43  18k  [RESC1005X04L]
SB5  Solderbridge  [Solderbridge_Shorted]  (value not drawn)  (net tie, no BOM)
SB6  Solderbridge  [Solderbridge_Shorted]  (value not drawn)  (net tie, no BOM)
SB7  Solderbridge  [Solderbridge_Shorted]  (value not drawn)  (net tie, no BOM)
SB8  Solderbridge  [Solderbridge_Shorted]  (value not drawn)  (net tie, no BOM)
SW1  PB SW  [Switch-PB-6.2x6.3mm-SMD]
SW2  PB SW  [Switch-PB-6.2x6.3mm-SMD]
SW3  PB SW  [Switch-PB-6.2x6.3mm-SMD]
SW4  PB SW  [Switch-PB-6.2x6.3mm-SMD]
SW5  PB SW  [Switch-PB-6.2x6.3mm-SMD]
U4  NX3DV2567  [XQFN40P180X260X50-16N]
U5  NX3DV2567  [XQFN40P180X260X50-16N]
U6  NX3DV2567  [XQFN40P180X260X50-16N]
U7  PCAL6408A  [XQFN40P180X260X50-16N]

### Ports
BOOT (out), BUTTON1 (bidir), BUTTON2 (bidir), BUTTON3 (bidir), BUTTON4 (bidir), IOEXP_IRQ (bidir), LED1 (bidir), LED2 (bidir), LED3 (bidir), LED4 (bidir), SCL (bidir), SDA (bidir), SHIELD_DETECT (in)

### Nets
GND: C44.1 C45.1 C46.1 C47.1 C48.2 C49.1 C50.1 C51.2 R38.1 SW1.1(N.O) SW2.1(N.O) SW3.1(N.O) SW4.1(N.O) SW5.1(N.O) U4.6(GND) U5.6(GND) U6.6(GND) U7.6(GND)
VDD: C44.2 C45.2 C46.2 R1.2 R2.2 R3.2 R4.2 R5.2 U4.14(VCC) U5.14(VCC) U6.14(VCC) U6.16(COM1)
VEXT: C47.2 R29.2 R30.2 R31.2 R32.2 R33.2 R34.2 R35.2 R36.2 R37.2 U6.1(NC1) U7.14(VDD(P)) U7.15(VDD(I2C))
BOOT: R5.1 SW5.2(COM) ; port BOOT
BUTTON1': SW1.2(COM) U4.16(COM1)
BUTTON1_EXT: C48.1 D3.3(C) R40.1 U7.2(IO0)
BUTTON2': SW2.2(COM) U4.4(COM2)
BUTTON2_EXT: C49.2 D4.3(C) R41.1 U7.3(IO1)
BUTTON3': SW3.2(COM) U4.8(COM3)
BUTTON3_EXT: C50.2 D5.3(C) R42.1 U7.4(IO2)
BUTTON4': SW4.2(COM) U4.12(COM4)
BUTTON4_EXT: C51.1 D6.3(C) R43.1 U7.5(IO3)
INT_EXT: R31.1 U6.5(NC2) U7.11(~{INT})
IOEXP_IRQ: U6.4(COM2) ; port IOEXP_IRQ
LED1': SB5.1 U5.16(COM1)
LED1_EXT: U5.1(NC1) U7.7(IO4)
LED2': SB6.1 U5.4(COM2)
LED2_EXT: U5.5(NC2) U7.8(IO5)
LED3': SB7.1 U5.8(COM3)
LED3_EXT: U5.9(NC3) U7.9(IO6)
LED4': SB8.1 U5.12(COM4)
LED4_EXT: U5.13(NC4) U7.10(IO7)
P0.13: U4.15(NO1) ; port BUTTON1
P0.14: U4.3(NO2) ; port BUTTON2
P0.15: U4.7(NO3) ; port BUTTON3
P0.16: U4.11(NO4) ; port BUTTON4
P0.17: U5.15(NO1) ; port LED1
P0.18: U5.3(NO2) ; port LED2
P0.19: U5.7(NO3) ; port LED3
P0.20: U5.11(NO4) ; port LED4
P0.26: U6.12(COM4) ; port SDA
P0.27: U6.8(COM3) ; port SCL
SCL_EXT: R30.1 U6.9(NC3) U7.12(SCL)
SDA_EXT: R29.1 U6.13(NC4) U7.13(SDA)
SHIELD_DETECT: U4.2(IN) U5.2(IN) U6.2(IN) ; port SHIELD_DETECT
NetD3_1: D3.1(A) R33.1 R40.2 U4.1(NC1)
NetD4_1: D4.1(A) R34.1 R41.2 U4.5(NC2)
NetD5_1: D5.1(A) R35.1 R42.2 U4.9(NC3)
NetD6_1: D6.1(A) R36.1 R43.2 U4.13(NC4)
NetLED1_1: LED1.1(C) SB5.2
NetLED1_2: LED1.2(A) R1.1
NetLED2_1: LED2.1(C) SB6.2
NetLED2_2: LED2.2(A) R2.1
NetLED3_1: LED3.1(C) SB7.2
NetLED3_2: LED3.2(A) R3.1
NetLED4_1: LED4.1(C) SB8.2
NetLED4_2: LED4.2(A) R4.1
NetR32_1: R32.1 U7.1(~{RESET})
NetR37_1: R37.1 R38.2 U7.16(ADDR)

Not connected (* = marked no-connect by the designer): U4 10(N.C.); U5 10(N.C.); U6 3(NO2) 7(NO3) 10(N.C.) 11(NO4) 15(NO1)

### Notes on the sheet
- Title
- Size
- Date:
- Project Number
- Sheet         of
- Revision
- File:
- Drawn By:

### Library data of the parts
C44-C47 = C0402-100n: as C4 on sheet pca10040_sheet2_radio; Part Number: C0402-100n; Manufacturer: *; Manufacturer Part Number: *; Datasheet: *; Footprint Doc: 0402; LatestRevisionDate: 2009-11-23; Pin Count: 2; Publisher: Nordic Semiconductor; Published: 2009-05-08; Value: 100nF; Supplier: *; Supplier part number: *; 2nd source Supplier: *; 2nd source part number: *
C48-C51 = C0402-1µ0: Capacitor, X5R, ±5%; Part number IPS: 00000006569; Note: 6.3V; Artikkelnr Noca: 20039235; Artikkelnr Simpro: N.A.; Part Number: C0402-1µ0; Manufacturer: *; Manufacturer Part Number: *; Datasheet: *; Footprint Doc: 0402; LatestRevisionDate: 2016-08-22; Pin Count: 2; Publisher: Nordic Semiconductor; Published: 2009-05-08; Value: 1.0µF; Supplier: Digi-Key; Supplier part number: 1276-1444-1-ND; 2nd source Supplier: *; 2nd source part number: *
D3-D6 = 1PS79SB30.115: Diode Schottky Vf=0.38, Vr=40V, If=200mA, Ir=500nA; Manufacturer: NXP; 2nd source part number: 873-4097; Artikkelnr Noca: 10029120; Artikkelnr Simpro: N.A.; Part Number: 1PS79SB30.115; Manufacturer Part Number: 1PS79SB30.115; Datasheet: http://www.nxp.com/documents/data_sheet/1PS79SB30.pdf; Footprint Doc: SOD-523; LatestRevisionDate: 2016-08-26; Pin Count: 2; Publisher: Nordic Semiconductor; Published: 2014-09-24; Value: 1PS79SB30.115; Note: *; Supplier: Digi-Key; Supplier part number: 568-5973-1-ND; 2nd source Supplier: Farnell
LED1-LED4 = LG L29K Smartled Green: LED SMARTLED GREEN 570NM 0603; Manufacturer: Osram; Manufacturer Part Number: LG L29K-G2J1-24-Z; 2nd source part number: 720-LGL29KG2J124Z; Note: 2,24..5.6 mcd, Vfmin=1.7V; Artikkelnr Noca: 13019147; Artikkelnr Simpro: N.A.; Part Number: LG L29K Smartled Green; Datasheet: http://www.osram-os.com/Graphics/XPic2/00077107_0.pdf; Footprint Doc: 0603; LatestRevisionDate: 2016-08-26; Pin Count: 2; Publisher: Nordic Semiconductor; Published: 2014-10-28; Value: L0603G; Supplier: Digi-Key; Supplier part number: 475-2709-1-ND; 2nd source Supplier: Mouser
R1-R4 = R0402-220: as R19 on sheet pca10040_sheet4_interface_mcu; Part Number: R0402-220; Manufacturer: *; Manufacturer Part Number: *; Datasheet: *; LatestRevisionDate: 2009-11-23; Pin Count: 2; Publisher: Nordic Semiconductor; Published: 2009-05-08; Value: 220R; Supplier: Farnell; Supplier part number: 173-8841; 2nd source Supplier: *; 2nd source part number: *; Footprint Doc: 0402
R5 = R0402-10k: as R8 on sheet pca10040_sheet4_interface_mcu; Part Number: R0402-10k; Manufacturer: *; Manufacturer Part Number: *; Datasheet: *; Footprint Doc: 0402; LatestRevisionDate: 2009-11-23; Pin Count: 2; Publisher: Nordic Semiconductor; Published: 2009-05-08; Value: 10k; Supplier: Farnell; Supplier part number: 173-8864; 2nd source Supplier: *; 2nd source part number: *
R29 R30 = R0402-4k7: Resistor, ±1%, 0.063W; Part number IPS: 00000003433; Note: Chip Res 1%; Artikkelnr Noca: 27049089; Artikkelnr Simpro: N.A.; Value Ohm: 4700; Part Number: R0402-4k7; Manufacturer: *; Manufacturer Part Number: *; Datasheet: *; Footprint Doc: 0402; LatestRevisionDate: 2009-11-23; Pin Count: 2; Publisher: Nordic Semiconductor; Published: 2009-05-08; Value: 4k7; Supplier: Farnell; Supplier part number: 173-8858; 2nd source Supplier: *; 2nd source part number: *
R31 R32 = R0402-12k: Resistor, ±1%, 0.063W; Note: Chip Res 1%; Artikkelnr Noca: 27049099; Artikkelnr Simpro: N.A.; Value Ohm: 12000; Part Number: R0402-12k; Manufacturer: *; Manufacturer Part Number: *; Datasheet: *; Footprint Doc: 0402; LatestRevisionDate: 2009-11-23; Pin Count: 2; Publisher: Nordic Semiconductor; Published: 2009-05-08; Value: 12k; Supplier: Farnell; Supplier part number: 173-8865; 2nd source Supplier: *; 2nd source part number: *
R33-R36 = R0402-100k: Resistor, ±1%, 0.063W; Part number IPS: 00000003667; Note: Chip Res 1%; Artikkelnr Noca: 27049121; Artikkelnr Simpro: N.A.; Value Ohm: 100000; Part Number: R0402-100k; Manufacturer: *; Manufacturer Part Number: *; Datasheet: *; Footprint Doc: 0402; LatestRevisionDate: 2009-11-23; Pin Count: 2; Publisher: Nordic Semiconductor; Published: 2009-05-08; Value: 100k; Supplier: Farnell; Supplier part number: 173-8877; 2nd source Supplier: *; 2nd source part number: *
R37 = R0402-N.C.: as R7 on sheet pca10040_sheet4_interface_mcu; Part Number: R0402-N.C.; Manufacturer: *; Manufacturer Part Number: *; Datasheet: *; Footprint Doc: 0402; LatestRevisionDate: 2009-05-08; Pin Count: 2; Publisher: Nordic Semiconductor; Published: 2009-05-08; Value: N.C.; Supplier: *; Supplier part number: *; 2nd source Supplier: *; 2nd source part number: *; Artikkelnr Simpro: N.A.
R38 = R0402-0R: Resistor, ±5%, 0.063W; Note: Chip Res 5%; Artikkelnr Noca: 27049000; Artikkelnr Simpro: N.A.; Value Ohm: 0; Part Number: R0402-0R; Manufacturer: *; Manufacturer Part Number: *; Datasheet: *; Footprint Doc: 0402; LatestRevisionDate: 2009-11-23; Pin Count: 2; Publisher: Nordic Semiconductor; Published: 2009-05-08; Value: 0R; Supplier: Farnell; Supplier part number: 146-9661; 2nd source Supplier: *; 2nd source part number: *
R40-R43 = R0402-18k: Resistor, ±1%, 0.063W; Part number IPS: 00000003300; Note: Chip Res 1%; Artikkelnr Noca: 27049103; Artikkelnr Simpro: N.A.; Value Ohm: 18000; Part Number: R0402-18k; Manufacturer: *; Manufacturer Part Number: *; Datasheet: *; Footprint Doc: 0402; LatestRevisionDate: 2009-11-23; Pin Count: 2; Publisher: Nordic Semiconductor; Published: 2009-05-08; Value: 18k; Supplier: Farnell; Supplier part number: 173-8867; 2nd source Supplier: *; 2nd source part number: *
SB5-SB8 = Solderbridge Shorted: as SB1 on sheet pca10040_sheet2_radio; Part Number: Solderbridge Shorted; Manufacturer: *; Manufacturer Part Number: *; Datasheet: *; LatestRevisionDate: 2012-08-07; Pin Count: 2; Publisher: Nordic Semiconductor; Published: 2012-08-07; Value: Solderbridge; Note: *; Supplier: *; Supplier part number: *; 2nd source Supplier: *; 2nd source part number: *; Footprint Doc: Solderbridge_Shorted; Artikkelnr Simpro: N.A.
SW1-SW5 = Switch-PB-6.2x6.3mm-SMD: Tactile Switch, SPNO, SMD, 160gf, 6.2x6.3x2.5mm; Manufacturer: Dailywell; Manufacturer Part Number: TS604VM1-025BR-R; 2nd source part number: 688-SKHUALE010; Artikkelnr Noca: 50019106; Artikkelnr Simpro: N.A.; Part Number: Switch-PB-6.2x6.3mm-SMD; Datasheet: \\hizz\pro\app9717\Datasheet\switches\Dailywell\TS604VM1-025BR-R.pdf; Footprint Doc: Switch-PB-6.2x6.3mm-SMD; LatestRevisionDate: 2016-04-21; Pin Count: 4; Publisher: Nordic Semiconductor; Published: 2010-02-01; Value: PB SW; Note: *; Supplier: Cabcon; Supplier part number: TS604VM1-025BR-R; 2nd source Supplier: Mouser
U4-U6 = NX3DV2567GU: Low-ohmic four-pole double-throw analog switch; Manufacturer: NXP Semiconductors; 2nd source part number: 771-NX3DV2567GU115; Artikkelnr Noca: 15079317; Artikkelnr Simpro: N.A.; Part Number: NX3DV2567GU; Manufacturer Part Number: NX3DV2567GU; Datasheet: http://www.nxp.com/documents/data_sheet/NX3DV2567.pdf; Footprint Doc: XQFN-16; LatestRevisionDate: 2015-02-17; Pin Count: 16; Publisher: Nordic Semiconductor; Published: 2015-02-17; Value: NX3DV2567; Note: *; Supplier: Digi-Key; Supplier part number: 568-5206-1-ND; 2nd source Supplier: Mouser
U7 = PCAL6408AHK: 8-bit I2C-bus I/O expander with interrupt output; Manufacturer: NXP Semiconductors; 2nd source part number: 771-PCAL6408AHKX; Artikkelnr Noca: 15079321; Artikkelnr Simpro: N.A.; Part Number: PCAL6408AHK; Manufacturer Part Number: PCAL6408AHK; Datasheet: http://www.nxp.com/documents/data_sheet/PCAL6408A.pdf; Footprint Doc: XQFN-16; LatestRevisionDate: 2015-04-29; Pin Count: 16; Publisher: Nordic Semiconductor; Published: 2015-04-29; Value: PCAL6408A; Note: *; Supplier: Digi-Key; Supplier part number: 568-9944-1-ND; 2nd source Supplier: Mouser